# Altium schematic sheet Cookie Connector.schdoc
size A4
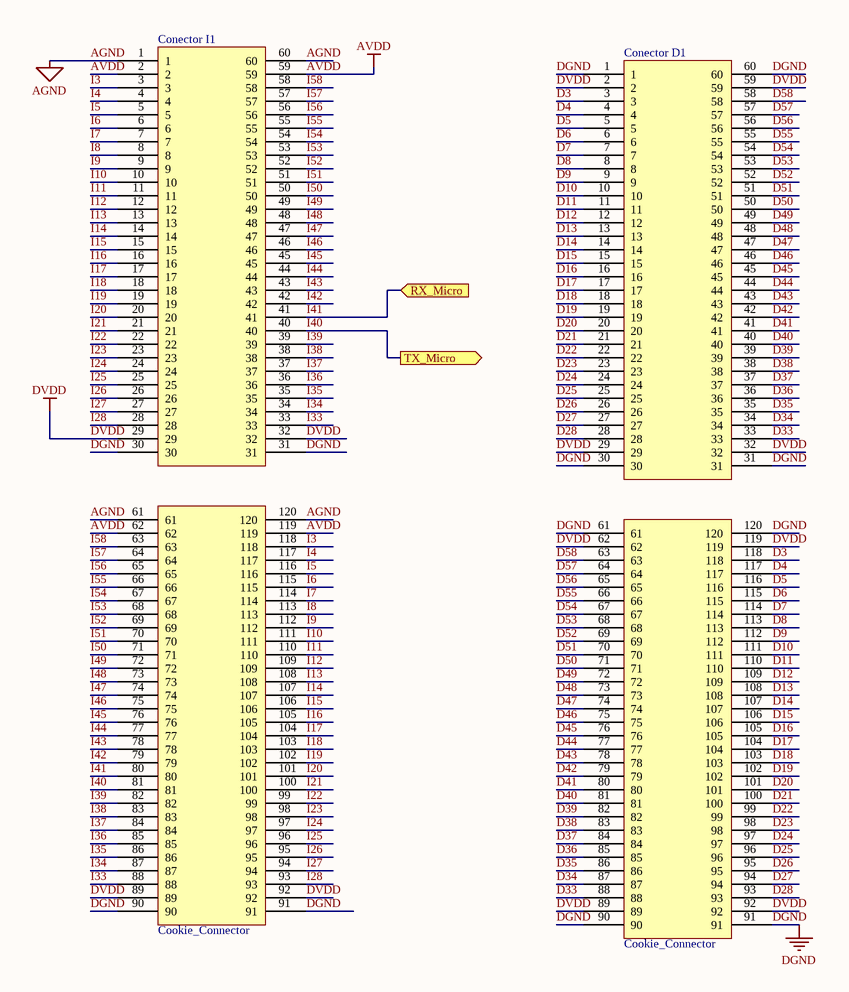
[diagram p0: Cookie Connector.schdoc]

## Parts
Conector_D1  Cookie_Connector  [COOKIECON_HEADER_AND_SOCKET]
Conector_I1  Cookie_Connector  [COOKIECON_HEADER_AND_SOCKET]

## Ports
RX_Micro (in), TX_Micro (out)

## Nets
AGND: Conector_I1.1 Conector_I1.60 Conector_I1.61 Conector_I1.120
AVDD: Conector_I1.2 Conector_I1.59 Conector_I1.62 Conector_I1.119
DGND: Conector_D1.1 Conector_D1.30 Conector_D1.31 Conector_D1.60 Conector_D1.61 Conector_D1.90 Conector_D1.91 Conector_D1.120 Conector_I1.30 Conector_I1.31 Conector_I1.90 Conector_I1.91
DVDD: Conector_D1.2 Conector_D1.29 Conector_D1.32 Conector_D1.59 Conector_D1.62 Conector_D1.89 Conector_D1.92 Conector_D1.119 Conector_I1.29 Conector_I1.32 Conector_I1.89 Conector_I1.92
D3: Conector_D1.3 Conector_D1.118
D4: Conector_D1.4 Conector_D1.117
D5: Conector_D1.5 Conector_D1.116
D6: Conector_D1.6 Conector_D1.115
D7: Conector_D1.7 Conector_D1.114
D8: Conector_D1.8 Conector_D1.113
D9: Conector_D1.9 Conector_D1.112
D10: Conector_D1.10 Conector_D1.111
D11: Conector_D1.11 Conector_D1.110
D12: Conector_D1.12 Conector_D1.109
D13: Conector_D1.13 Conector_D1.108
D14: Conector_D1.14 Conector_D1.107
D15: Conector_D1.15 Conector_D1.106
D16: Conector_D1.16 Conector_D1.105
D17: Conector_D1.17 Conector_D1.104
D18: Conector_D1.18 Conector_D1.103
D19: Conector_D1.19 Conector_D1.102
D20: Conector_D1.20 Conector_D1.101
D21: Conector_D1.21 Conector_D1.100
D22: Conector_D1.22 Conector_D1.99
D23: Conector_D1.23 Conector_D1.98
D24: Conector_D1.24 Conector_D1.97
D25: Conector_D1.25 Conector_D1.96
D26: Conector_D1.26 Conector_D1.95
D27: Conector_D1.27 Conector_D1.94
D28: Conector_D1.28 Conector_D1.93
D33: Conector_D1.33 Conector_D1.88
D34: Conector_D1.34 Conector_D1.87
D35: Conector_D1.35 Conector_D1.86
D36: Conector_D1.36 Conector_D1.85
D37: Conector_D1.37 Conector_D1.84
D38: Conector_D1.38 Conector_D1.83
D39: Conector_D1.39 Conector_D1.82
D40: Conector_D1.40 Conector_D1.81
D41: Conector_D1.41 Conector_D1.80
D42: Conector_D1.42 Conector_D1.79
D43: Conector_D1.43 Conector_D1.78
D44: Conector_D1.44 Conector_D1.77
D45: Conector_D1.45 Conector_D1.76
D46: Conector_D1.46 Conector_D1.75
D47: Conector_D1.47 Conector_D1.74
D48: Conector_D1.48 Conector_D1.73
D49: Conector_D1.49 Conector_D1.72
D50: Conector_D1.50 Conector_D1.71
D51: Conector_D1.51 Conector_D1.70
D52: Conector_D1.52 Conector_D1.69
D53: Conector_D1.53 Conector_D1.68
D54: Conector_D1.54 Conector_D1.67
D55: Conector_D1.55 Conector_D1.66
D56: Conector_D1.56 Conector_D1.65
D57: Conector_D1.57 Conector_D1.64
D58: Conector_D1.58 Conector_D1.63
I3: Conector_I1.3 Conector_I1.118
I4: Conector_I1.4 Conector_I1.117
I5: Conector_I1.5 Conector_I1.116
I6: Conector_I1.6 Conector_I1.115
I7: Conector_I1.7 Conector_I1.114
I8: Conector_I1.8 Conector_I1.113
I9: Conector_I1.9 Conector_I1.112
I10: Conector_I1.10 Conector_I1.111
I11: Conector_I1.11 Conector_I1.110
I12: Conector_I1.12 Conector_I1.109
I13: Conector_I1.13 Conector_I1.108
I14: Conector_I1.14 Conector_I1.107
I15: Conector_I1.15 Conector_I1.106
I16: Conector_I1.16 Conector_I1.105
I17: Conector_I1.17 Conector_I1.104
I18: Conector_I1.18 Conector_I1.103
I19: Conector_I1.19 Conector_I1.102
I20: Conector_I1.20 Conector_I1.101
I21: Conector_I1.21 Conector_I1.100
I22: Conector_I1.22 Conector_I1.99
I23: Conector_I1.23 Conector_I1.98
I24: Conector_I1.24 Conector_I1.97
I25: Conector_I1.25 Conector_I1.96
I26: Conector_I1.26 Conector_I1.95
I27: Conector_I1.27 Conector_I1.94
I28: Conector_I1.28 Conector_I1.93
I33: Conector_I1.33 Conector_I1.88
I34: Conector_I1.34 Conector_I1.87
I35: Conector_I1.35 Conector_I1.86
I36: Conector_I1.36 Conector_I1.85
I37: Conector_I1.37 Conector_I1.84
I38: Conector_I1.38 Conector_I1.83
I39: Conector_I1.39 Conector_I1.82
I40: Conector_I1.40 Conector_I1.81 ; port TX_Micro
I41: Conector_I1.41 Conector_I1.80 ; port RX_Micro
I42: Conector_I1.42 Conector_I1.79
I43: Conector_I1.43 Conector_I1.78
I44: Conector_I1.44 Conector_I1.77
I45: Conector_I1.45 Conector_I1.76
I46: Conector_I1.46 Conector_I1.75
I47: Conector_I1.47 Conector_I1.74
I48: Conector_I1.48 Conector_I1.73
I49: Conector_I1.49 Conector_I1.72
I50: Conector_I1.50 Conector_I1.71
I51: Conector_I1.51 Conector_I1.70
I52: Conector_I1.52 Conector_I1.69
I53: Conector_I1.53 Conector_I1.68
I54: Conector_I1.54 Conector_I1.67
I55: Conector_I1.55 Conector_I1.66
I56: Conector_I1.56 Conector_I1.65
I57: Conector_I1.57 Conector_I1.64
I58: Conector_I1.58 Conector_I1.63